# EasyEDA Pro project skyrizz_e32_se050.epro, board PCB1_8
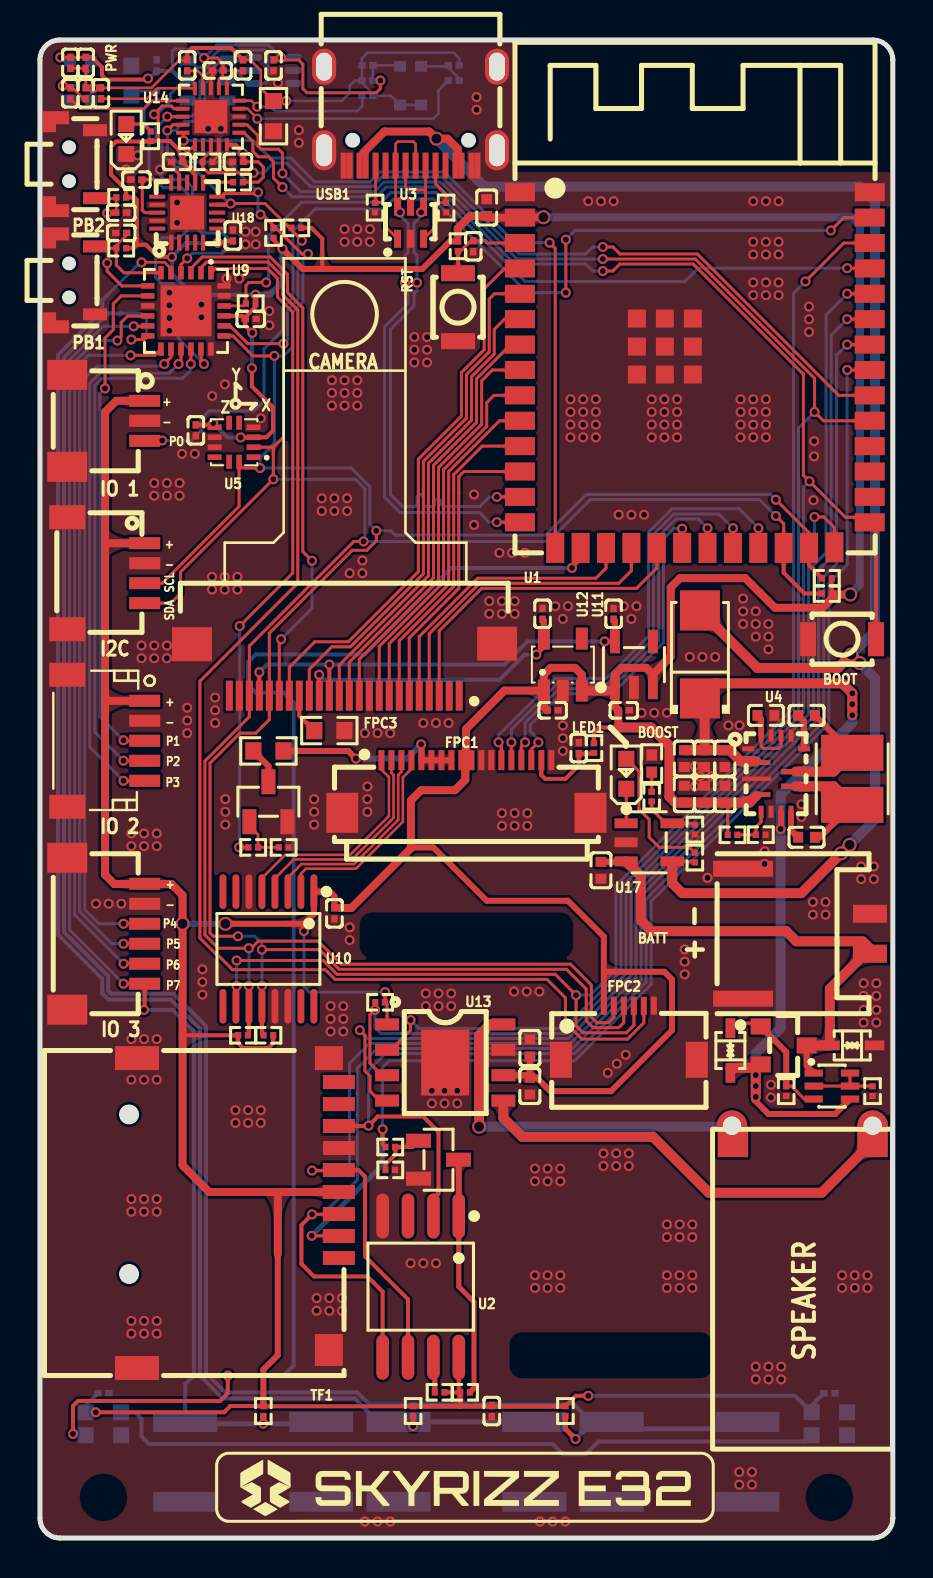
[diagram p6: board, top side]
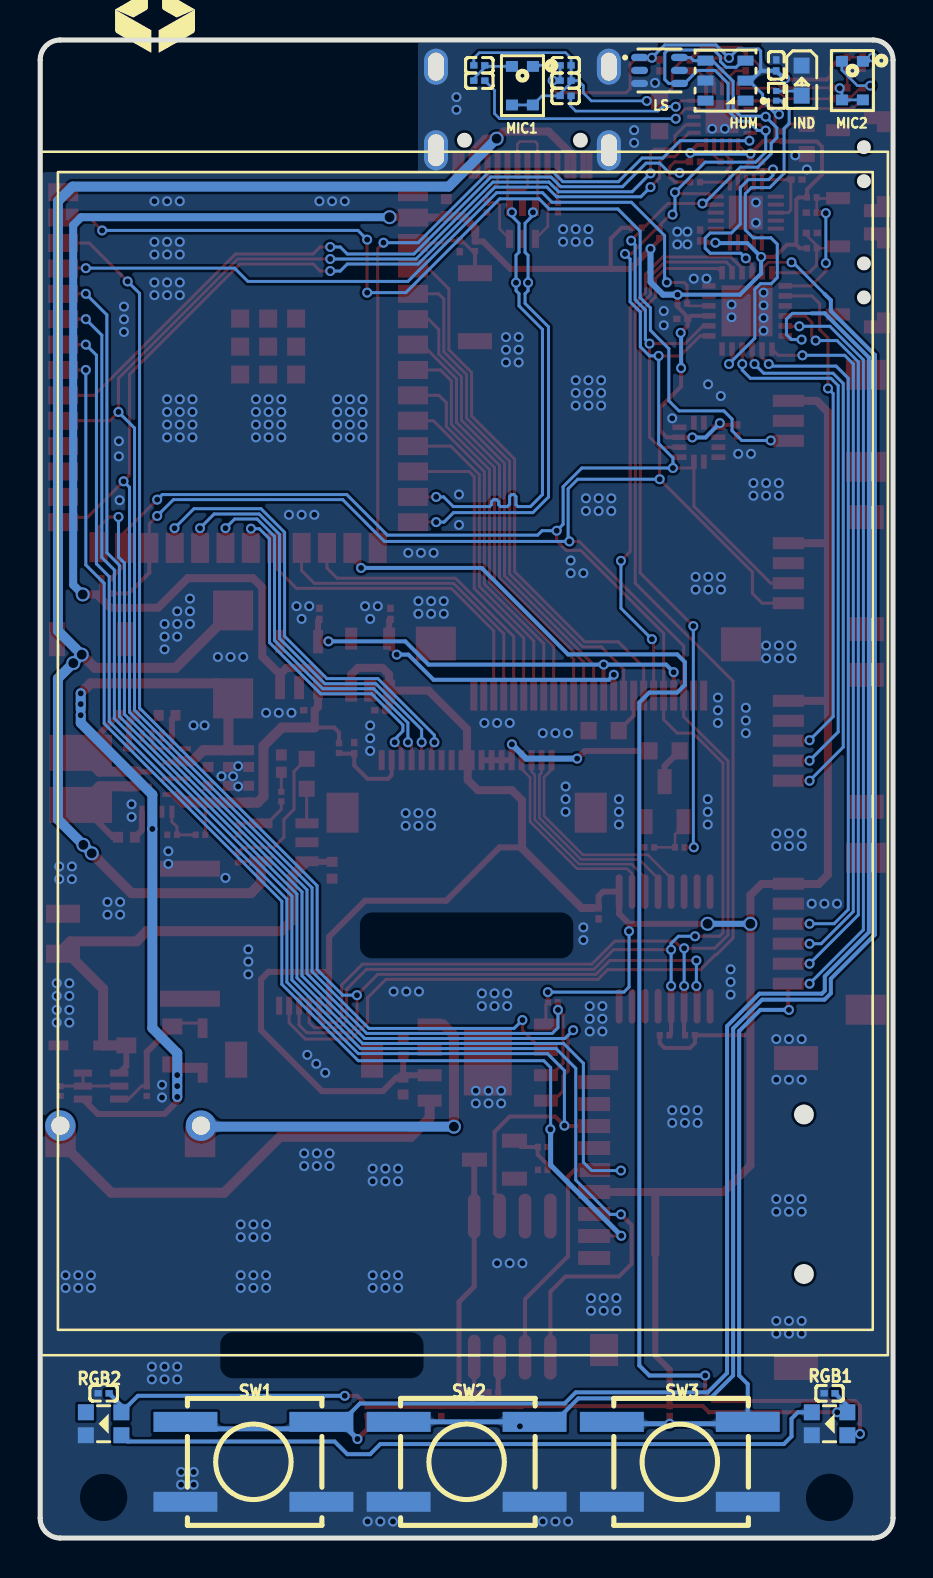
[diagram p7: board, bottom side, seen from below]

Outline 42.67 x 74.93 mm; copper layers: Top Layer, Bottom Layer. Coordinates in mm from the lower left corner of the outline.
Outline path: 0,73.93 0,1 arc(0.29,0.29) 1,0 41.67,0 arc(42.38,0.29) 42.67,1 42.67,73.93 arc(42.38,74.64) 41.67,74.93 1,74.93 arc(0.29,74.64) 0,73.93
Stack: Top Layer 0.035mm / Dielectric1 1.51mm FR4 er 4.5 / Bottom Layer 0.035mm

## Design rules (mm)
net DN: DP1
net DP: DP1
template: Custom Config
spacing copperThickness1oz (default): track to track 0.102, other pairs 0.102 to 0.3
spacing copperThickness2oz: track to track 0.203, other pairs 0.152 to 0.3
track width copperThickness1oz (default): min 0.127, default 0.254, max 2.54
track width copperThickness2oz: min 0.203, default 0.254, max 2.54
differential pair differentialPair (default): width min 0.127, default 0.254, max 2.54; gap min 0.152, default 0.152
via viaSize (default): diameter min 0.5, default 0.5, max 10; hole min 0.3, default 0.3, max 6.3

## Placement (name value [footprint] x y rotation side)
BATT  PH-2P卧贴  [CONN-SMD_2P-P2.00_PH2.0-SPWB]  38.35 30.23 90 top
BOOT  B3U-1000P  [KEY-SMD_B3U-1000PM]  40.13 44.96 0 top
C1  10uF  [C0402]  22.35 66.55 270 top
C2  22uF  [C0402]  24.51 22.61 90 top
C3  1uF  [C0201]  21.68 64.61 90 top
C6  15pF  [C0201]  20.7 73.66 180 bottom
C12  100nF  [C0201]  9.65 65.15 270 top
C18  100nF  [C0201]  16.38 73.66 0 bottom
C19  100nF  [C0201]  10.54 60.98 180 top
C20  100nF  [C0201]  4.06 66.29 180 top
C21  100nF  [C0201]  4.06 65.28 0 top
C22  100nF  [C0201]  39.5 7.24 180 bottom
C23  100nF  [C0201]  22.61 6.35 90 top
C24  100nF  [C0201]  3.18 7.24 180 bottom
C25  100nF  [C0201]  26.96 39.51 270 top
C26  1uF  [C0201]  16.38 72.9 0 bottom
C27  1uF  [C0201]  20.7 72.9 0 bottom
C28  1uF  [C0201]  16.38 72.14 0 bottom
C29  100nF  [C0201]  8.89 73.41 0 top
C30  100nF  [C0201]  6.86 68.83 0 top
C36  100nF  [C0201]  2.29 73.79 90 top
C37  1uF  [C0201]  1.52 73.79 90 top
C38  1uF  [C0201]  1.52 72.26 90 top
C39  1uF  [C0201]  3.05 72.26 90 top
C40  15pF  [C0201]  2.29 72.26 270 top
C41  100nF  [C0201]  9.91 68.83 0 top
C42  1uF  [C0201]  10.16 73.66 270 top
C43  1uF  [C0201]  7.37 73.66 270 top
C45  22uF  [C0402]  24.51 24.51 270 top
C46  2.2uF  [C0201]  29.21 41.4 180 top
C47  2.2uF  [C0201]  28.7 46.23 270 top
C48  2.2uF  [C0201]  25.65 41.4 180 top
C50  2.2uF  [C0201]  25.15 46.23 270 top
C51  10uF  [C0402]  33.25 38.98 90 top
C52  10uF  [C0402]  32.24 38.98 90 top
C54  1uF  [C0402]  36.32 41.15 0 top
C56  100nF  [C0402]  38.35 41.15 0 top
C57  100nF  [C0402]  38.35 35.05 0 top
C58  100nF  [C0402]  34.27 38.98 90 top
C59  10uF  [C0402]  34.27 37.21 270 top
C60  10uF  [C0402]  33.25 37.21 270 top
C61  100nF  [C0402]  32.24 37.21 270 top
C62  100nF  [C0201]  5.84 73.66 270 bottom
C63  100nF  [C0201]  11.68 73.66 90 top
C64  100nF  [C0201]  7.8 55.4 90 top
C65  100nF  [C0201]  14.73 31.24 90 top
C66  10uF  [C0402]  28.07 33.4 90 top
C67  100nF  [C0201]  4.83 67.94 0 top
C_I2C  SM04B-SRSS-TB(LF)(SN)  [CONN-SMD_4P-P1.00_SM04B-SRSS-TB-LF-SN]  3.3 48.26 270 top
C_P0  SM03B-SRSS-TB(LF)(SN)  [CONN-SMD_SM03B-SRSS-TB-LF-SN-P]  3.3 55.88 270 top
C_P1-3  SM05B-SRSS-TB(LF)(SN)  [CONN-SMD_SM05B-SRSS-TB-LF-SN]  3.3 39.88 270 top
C_P4-7  SM06B-SRSS-TB(LF)(SN)  [CONN-SMD_SM06B-SRSS-TB-LF-SN]  3.3 30.23 270 top
D2  SS34  [SMA_L4.3-W2.6-LS5.2-RD]  33.02 44.2 90 top
D5  PTVSUC3D5VB  [SOD-323_L1.8-W1.3-LS2.5-BI]  40.64 24.64 180 top
D6  PTVSUC3D5VB  [SOD-323_L1.8-W1.3-LS2.5-BI]  34.54 24.38 90 top
FPC1  FPC-0.5FX-18PWBH15  [FPC-SMD_18P-P0.50_XUNPU_FPC-0.5FX-18PWBH15]  21.34 37.59 0 top
FPC2  FPC06-T1T1-2021-A  [FPC-SMD_FPC06-T1T1-2021-A]  29.46 25.27 0 top
FPC3  FPC-0.5FX-24PH20  [FPC-SMD_24P-P0.50_YUANDI_FPC-0.5FX-24PH20]  15.24 43.43 180 top
HUM  AHT20  [SENSOR-SMD_L3.0-W3.0-P1.00-BR]  8.38 72.9 180 bottom
IND  KT-0603YG  [LED0603-RD]  4.57 72.9 270 bottom
L1  2.2uH  [IND-SMD_L3.5-W3.0]  40.64 37.97 90 top
LED1  KT-0603R  [LED0603-RD]  29.34 38.23 90 top
LS  LTR-303ALS-01  [TDFN-6_L2.0-W2.0-P0.65-BL]  11.68 73.41 270 bottom
MIC1  MSM381ACP003  [MIC-SMD_4P-L2.8-W1.9-TR_MSM381ACP003]  18.54 72.64 180 bottom
MIC2  MSM381ACP003  [MIC-SMD_4P-L2.8-W1.9-TR_MSM381ACP003]  2.03 72.9 180 bottom
NOREF  -  [Pad_e582]  41.66 19.81 0 top
NOREF#2  -  [Pad_e83]  41.66 20.62 0 top
NOREF#3  -  [Pad_e581]  34.67 19.81 0 top
NOREF#4  -  [Pad_e85]  34.62 20.62 0 top
PB1  TS24CA  [SW-SMD_2P-TS24CA]  1.78 62.9 90 top
PB2  TS24CA  [SW-SMD_2P-TS24CA]  1.78 68.72 90 top
PWR  KT-0603R  [LED0603-RD]  4.32 69.98 90 top
Q2  AO3401A  [SOT-23-3_L2.9-W1.3-P1.90-LS2.4-BR_SMV2022-004LF]  37.21 24.64 180 top
Q3  BCM857BS  [SOT-363_L2.1-W1.3-P0.65-LS2.3-BL]  39.62 22.61 270 top
Q4  MMBT3904  [SOT-23-3_L2.9-W1.3-P1.90-LS2.4-BR]  11.43 36.83 270 top
Q5  MMBT3904  [SOT-23-3_L2.9-W1.3-P1.90-LS2.4-BR]  19.94 18.92 180 top
R1  10kΩ  [R0201]  20.92 64.61 90 top
R2  1kΩ  [R0201]  32.77 34.04 90 top
R3  5.1kΩ  [R0201]  16.76 66.55 90 top
R4  10kΩ  [R0201]  17.02 26.8 0 top
R5  5.1kΩ  [R0201]  20.32 66.55 270 top
R6  10kΩ  [R0201]  4.06 67.06 0 top
R7  10kΩ  [R0201]  4.06 64.52 0 top
R12  10kΩ  [R0201]  39.37 47.24 180 top
R13  10kΩ  [R0201]  39.37 48.01 0 top
R14  10kΩ  [R0201]  10.54 61.74 0 top
R15  2kΩ  [R0201]  5.54 70.11 270 top
R16  2kΩ  [R0201]  5.84 72.14 90 bottom
R17  4.7Ω  [R0603]  11.43 39.37 0 top
R18  10kΩ  [R0201]  12.19 34.54 180 top
R19  2kΩ  [R0201]  10.67 34.54 180 top
R20  10kΩ  [R0201]  27.72 39.51 90 top
R21  3.3kΩ  [R0201]  8.38 68.83 0 top
R22  0Ω  [R0603]  11.68 71.12 270 top
R23  27kΩ  [R0201]  34.65 35.17 180 top
R24  10kΩ  [R0201]  36.07 35.18 0 top
R25  100kΩ  [R0201]  41.66 22.35 90 top
R26  100kΩ  [R0201]  37.34 22.35 90 top
R27  10kΩ  [R0201]  17.53 18.41 180 top
R28  10kΩ  [R0201]  17.53 19.56 180 top
R29  10kΩ  [R0201]  21.27 7.29 180 top
R31  10kΩ  [R0201]  20 7.29 180 top
R32  0Ω  [R0603]  14.48 40.39 0 top
R33  10kΩ  [R0201]  10.16 25.15 0 top
R34  10kΩ  [R0201]  11.43 25.15 0 top
R35  10kΩ  [R0201]  12.83 65.53 180 top
R36  10kΩ  [R0201]  11.68 65.28 270 top
R37  10kΩ  [R0201]  26.29 6.35 90 top
R38  10kΩ  [R0201]  18.67 6.35 90 top
R39  10kΩ  [R0201]  11.18 6.35 90 top
R40  10kΩ  [R0201]  32.77 35.43 90 top
R41  2kΩ  [R0201]  30.61 37.08 90 top
R42  0Ω  [R0402]  30.61 38.73 90 top
R43  10kΩ  [R0201]  9.91 67.82 0 top
RGB1  XL-0807RGBC-2812B  [LED-SMD_4P-L2.0-W1.8_XL-0807RGBC-WS2812B]  3.18 5.72 180 bottom
RGB2  XL-0807RGBC-2812B  [LED-SMD_4P-L2.0-W1.8_XL-0807RGBC-WS2812B]  39.5 5.72 180 bottom
RST  B3U-1000P  [KEY-SMD_B3U-1000PM]  20.92 61.56 270 top
SW1  EVQQ2B03W  [KEY-SMD_4P-L6.5-W6.0-P4.0-LS6.6]  32 3.81 180 bottom
SW2  EVQQ2B03W  [KEY-SMD_4P-L6.5-W6.0-P4.0-LS6.6]  21.34 3.81 180 bottom
SW3  EVQQ2B03W  [KEY-SMD_4P-L6.5-W6.0-P4.0-LS6.6]  10.67 3.81 180 bottom
TF1  TF-CARD H1.8  [TF-SMD_TF-CARD-H1.8]  9.91 16.26 270 top
U1  ESP32-S3-WROOM-1-N16R8  [WIRELM-SMD_ESP32-S3-WROOM-1]  32.77 58.42 0 top
U2  GT30L24A3W  [SOIC-8_L5.3-W5.3-P1.27-LS8.0-BL]  19.05 12.57 180 top
U3  PUSB2X4Y  [SOT-363-6_L2.0-W1.3-P0.65-LS2.1-BL]  18.54 65.79 0 top
U4  JW3651QFNE#TRPBF  [QFN-15_L4.0-W3.0_JW3655E]  36.83 38.23 0 top
U5  SC7A20HTR  [LGA-12_L2.0-W2.0-P0.50-TL]  9.71 54.81 180 top
U9  XL9535QF24  [QFN-24_L4.0-W4.0-P0.50-BL-EP2.6]  7.3 61.38 180 top
U10  TSC2007IPWR  [TSSOP-16_L5.0-W4.4-P0.65-LS6.4-BL]  11.43 29.46 180 top
U11  BL8555-28PRA  [SOT-23-5_L3.0-W1.7-P0.95-LS2.8-BL]  29.72 43.69 0 top
U12  AP7343Q-18W5-7  [SOT-23-5_L3.0-W1.7-P0.95-LS2.8-BR]  26.16 43.69 270 top
U13  NS4168  [ESOP-8_L4.9-W3.9-P1.27-LS6.0-BL-EP]  20.28 23.78 270 top
U14  ES7243E  [QFN-20_L3.0-W3.0-P0.40-BL-EP1.7]  8.55 71.09 0 top
U17  MCP73831T-2ACI/OT  [SOT-23-5_L3.0-W1.7-P0.95-LS2.8-BL]  30.48 34.8 270 top
U18  SE050C2HQ1/Z01SDZ  [WQFN-20_L3.0-W3.0-P0.40-BL-EP1.7]  7.37 66.29 0 top
USB1  USB-TYPE-C-018  [USB-C_SMD-TYPE-C-31-M-12]  18.54 71.12 180 top

## Footprints (pads in the part's own frame, mm; a bottom-side part is the same pattern mirrored in y, then rotated)
C0201
  rect 0.368x0.324 smd: 1(-0.275,0) 2(0.275,0)
C0402
  rect 0.5x0.54 smd: 1(-0.42,0) 2(0.42,0)
CONN-SMD_2P-P2.00_PH2.0-SPWB
  rect 0.9x1.7 smd: 1(1,-3.175) 2(-1,-3.175)
  rect 0.8x3 smd: 3(-3.25,3.175) 4(3.25,3.175)
CONN-SMD_4P-P1.00_SM04B-SRSS-TB-LF-SN
  rect 0.6x1.55 smd: 1(-1.5,1.938) 2(-0.5,1.938) 3(0.5,1.938) 4(1.5,1.938)
  rect 1.2x1.8 smd: 5(2.8,-1.938) 6(-2.8,-1.938)
CONN-SMD_SM03B-SRSS-TB-LF-SN-P
  rect 0.6x1.55 smd: 1(-1,1.938) 2(0,1.938) 3(1,1.938)
  rect 1.5x2 smd: 4(2.3,-1.938) 5(-2.3,-1.938)
CONN-SMD_SM05B-SRSS-TB-LF-SN
  rect 0.6x1.55 smd: 1(-2,1.938) 2(-0.999,1.938) 3(0.001,1.938) 4(1,1.938) 5(2.001,1.938)
  rect 1.2x1.8 smd: 6(-3.3,-1.938) 7(3.3,-1.938)
CONN-SMD_SM06B-SRSS-TB-LF-SN
  rect 0.6x1.55 smd: 1(-2.5,1.938) 2(-1.5,1.938) 3(-0.5,1.938) 4(0.5,1.938) 5(1.5,1.938) 6(2.5,1.938)
  rect 1.5x2 smd: 7(3.8,-1.938) 8(-3.8,-1.938)
ESOP-8_L4.9-W3.9-P1.27-LS6.0-BL-EP
  rect 0.6x1.2 smd: 1(-1.905,-2.909) 2(-0.635,-2.909) 3(0.635,-2.909) 4(1.905,-2.909) 5(1.905,2.909) 6(0.635,2.909) 7(-0.635,2.909) 8(-1.905,2.909)
  rect 3.3x2.4 smd: 9(0,0)
FPC-SMD_18P-P0.50_XUNPU_FPC-0.5FX-18PWBH15
  rect 0.3x1 smd: 1(-4.25,1.315) 2(-3.75,1.315) 3(-3.25,1.315) 4(-2.75,1.315) 5(-2.25,1.315) 6(-1.75,1.315) 7(-1.25,1.315) 8(-0.75,1.315) 9(-0.25,1.315) 10(0.25,1.315) 11(0.75,1.315) 12(1.25,1.315) 13(1.75,1.315) 14(2.25,1.315) 15(2.75,1.315) 16(3.25,1.315) 17(3.75,1.315) 18(4.25,1.315)
  rect 1.6x2 smd: 19(6.21,-1.315) 20(-6.21,-1.315)
FPC-SMD_24P-P0.50_YUANDI_FPC-0.5FX-24PH20
  rect 0.35x1.5 smd: 1(-5.735,1.3) 2(-5.235,1.3) 3(-4.735,1.3) 4(-4.235,1.3) 5(-3.735,1.3) 6(-3.235,1.3) 7(-2.735,1.3) 8(-2.235,1.3) 9(-1.735,1.3) 10(-1.235,1.3) 11(-0.735,1.3) 12(-0.235,1.3) 13(0.265,1.3) 14(0.765,1.3) 15(1.265,1.3) 16(1.765,1.3) 17(2.265,1.3) 18(2.765,1.3) 19(3.265,1.3) 20(3.765,1.3) 21(4.265,1.3) 22(4.765,1.3) 23(5.265,1.3) 24(5.765,1.3)
  rect 2x1.7 smd: 25(7.635,-1.27) 26(-7.635,-1.3)
FPC-SMD_FPC06-T1T1-2021-A
  rect 0.3x0.9 smd: 1(-1.25,1.35) 2(-0.75,1.35) 3(-0.25,1.35) 4(0.25,1.35) 5(0.75,1.35) 6(1.25,1.35)
  rect 1.1x1.8 smd: 7(3.4,-1.35) 8(-3.4,-1.35)
IND-SMD_L3.5-W3.0
  rect 1.8x3.12 smd: 1(1.303,0) 2(-1.303,0)
KEY-SMD_4P-L6.5-W6.0-P4.0-LS6.6
  rect 3.2x1 smd: 1(-3.4,2) 2(3.4,2) 3(-3.4,-2) 4(3.4,-2)
KEY-SMD_B3U-1000PM
  rect 0.8x1.7 smd: 1(-1.7,0) 2(1.7,0)
LED0603-RD
  rect 0.8x0.8 smd: 1(-0.749,0) 2(0.749,0)
LED-SMD_4P-L2.0-W1.8_XL-0807RGBC-WS2812B
  rect 0.8x0.8 smd: 1(-0.889,0.575) 2(-0.889,-0.575) 3(0.889,-0.575) 4(0.889,0.575)
LGA-12_L2.0-W2.0-P0.50-TL
  rect 0.7x0.28 smd: 1(-0.975,0.75) 2(-0.975,0.25) 3(-0.975,-0.25) 4(-0.975,-0.75) 7(0.975,-0.75) 8(0.975,-0.25) 9(0.975,0.25) 10(0.975,0.75)
  rect 0.28x0.7 smd: 5(-0.25,-0.975) 6(0.25,-0.975) 11(0.25,0.975) 12(-0.25,0.975)
MIC-SMD_4P-L2.8-W1.9-TR_MSM381ACP003
  rect 0.6x0.54 smd: 1(0.525,0.965) 2(-0.525,0.965) 3(-0.525,-0.965) 4(0.525,-0.965)
Pad_e83
  round 1.524 hole 0.914: 1(0,0)
Pad_e85
  round 1.524 hole 0.914: 2(0,0)
Pad_e581
  rect 1.524x1.524 smd: 2(0,0)
Pad_e582
  rect 1.524x1.524 smd: 1(0,0)
QFN-15_L4.0-W3.0_JW3655E
  rect 0.6x0.25 smd: 1(-1.4,1.25) 11(1.4,1.25)
  custom 1.42x0.45 smd: 2(-0.99,0.62) 4(-0.99,-1.1)
  custom 1.45x0.22 smd: 3(-0.875,-0.25)
  rect 0.25x0.6 smd: 5(-0.75,-1.9) 6(-0.25,-1.9) 7(0.25,-1.9) 8(0.75,-1.9) 12(0.75,1.9) 13(0.25,1.9) 14(-0.25,1.9) 15(-0.75,1.9)
  custom 1.45x0.4 smd: 9(0.975,-0.625) 10(0.975,0.105)
QFN-20_L3.0-W3.0-P0.40-BL-EP1.7
  rect 0.2x0.665 smd: 1(-0.8,-1.407) 2(-0.4,-1.407) 3(0,-1.407) 4(0.4,-1.407) 5(0.8,-1.407) 11(0.8,1.407) 12(0.4,1.407) 13(0,1.407) 14(-0.4,1.407) 15(-0.8,1.407)
  rect 0.665x0.2 smd: 6(1.407,-0.8) 7(1.407,-0.4) 8(1.407,0) 9(1.407,0.4) 10(1.407,0.8) 16(-1.407,0.8) 17(-1.407,0.4) 18(-1.407,0) 19(-1.407,-0.4) 20(-1.407,-0.8)
  rect 1.65x1.65 smd: 21(0,0)
QFN-24_L4.0-W4.0-P0.50-BL-EP2.6
  rect 0.28x0.665 smd: 1(-1.25,-1.907) 2(-0.75,-1.907) 3(-0.25,-1.907) 4(0.25,-1.907) 5(0.75,-1.907) 6(1.25,-1.907) 13(1.25,1.907) 14(0.75,1.907) 15(0.25,1.907) 16(-0.25,1.907) 17(-0.75,1.907) 18(-1.25,1.907)
  rect 0.665x0.28 smd: 7(1.907,-1.25) 8(1.907,-0.75) 9(1.907,-0.25) 10(1.907,0.25) 11(1.907,0.75) 12(1.907,1.25) 19(-1.907,1.25) 20(-1.907,0.75) 21(-1.907,0.25) 22(-1.907,-0.25) 23(-1.907,-0.75) 24(-1.907,-1.25)
  rect 2.55x2.55 smd: 25(0,0)
R0201
  rect 0.303x0.324 smd: 1(-0.241,0) 2(0.241,0)
R0402
  rect 0.566x0.54 smd: 1(-0.433,0) 2(0.433,0)
R0603
  rect 0.806x0.864 smd: 1(-0.753,0) 2(0.753,0)
SENSOR-SMD_L3.0-W3.0-P1.00-BR
  rect 0.8x0.5 smd: 1(1,-1) 2(1,0) 3(1,1) 4(-1,1) 5(-1,0) 6(-1,-1)
SMA_L4.3-W2.6-LS5.2-RD
  rect 2x2 smd: 1(-2.2,0) 2(2.2,0)
SOD-323_L1.8-W1.3-LS2.5-BI
  rect 0.985x0.49 smd: 1(-1.117,0) 2(1.117,0)
SOIC-8_L5.3-W5.3-P1.27-LS8.0-BL
  oval 0.63x2.25 smd: 1(-1.905,-3.53) 2(-0.635,-3.53) 3(0.635,-3.53) 4(1.905,-3.53) 5(1.905,3.53) 6(0.635,3.53) 7(-0.635,3.53) 8(-1.905,3.53)
SOT-23-3_L2.9-W1.3-P1.90-LS2.4-BR
  rect 1.25x0.7 smd: 1(1,-0.95) 2(1,0.95) 3(-1,0)
SOT-23-3_L2.9-W1.3-P1.90-LS2.4-BR_SMV2022-004LF
  rect 1x0.8 smd: 1(1.15,-0.95) 2(1.15,0.95) 3(-1.15,0)
SOT-23-5_L3.0-W1.7-P0.95-LS2.8-BL
  rect 0.49x1.157 smd: 1(-0.95,-1.153) 2(0,-1.153) 3(0.95,-1.153)
  rect 0.49x1.175 smd: 4(0.95,1.153) 5(-0.95,1.153)
SOT-23-5_L3.0-W1.7-P0.95-LS2.8-BR
  rect 1.1x0.6 smd: 1(1.3,-0.95) 2(1.3,0) 3(1.3,0.95) 4(-1.3,0.95) 5(-1.3,-0.95)
SOT-363-6_L2.0-W1.3-P0.65-LS2.1-BL
  rect 0.35x0.9 smd: 1(-0.65,-0.8) 2(0,-0.8) 3(0.65,-0.8) 4(0.65,0.8) 5(0,0.8) 6(-0.65,0.8)
SOT-363_L2.1-W1.3-P0.65-LS2.3-BL
  rect 0.35x0.916 smd: 1(-0.65,-0.908) 2(0,-0.908) 3(0.65,-0.908) 4(0.65,0.908) 5(0,0.908) 6(-0.65,0.908)
SW-SMD_2P-TS24CA
  rect 0.6x1.2 smd: 1(-1.7,-0.975) 2(1.7,-0.975)
  custom 1.05x1.3 smd: 3(2.125,0.975) 4(-2.125,0.975)
TDFN-6_L2.0-W2.0-P0.65-BL
  oval 0.364x0.847 smd: 1(-0.65,-0.999) 2(0,-0.999) 3(0.65,-0.999) 4(0.65,0.999) 5(0,0.999) 6(-0.65,0.999)
TF-SMD_TF-CARD-H1.8
  rect 0.7x1.6 smd: 1(2.25,5.05) 2(1.15,5.05) 3(0.05,5.05) 4(-1.05,5.05) 5(-2.15,5.05) 6(-3.25,5.05) 7(-4.35,5.05) 8(-5.45,5.05) 9(-6.55,5.05)
  rect 1.2x1.4 smd: 10(-7.747,4.55)
  rect 1.2x2.2 smd: 11(-7.75,-5.05) 12(7.75,-5.05)
  rect 1.6x1.4 smd: 13(6.85,4.55)
TSSOP-16_L5.0-W4.4-P0.65-LS6.4-BL
  oval 0.343x1.732 smd: 1(-2.275,-2.866) 2(-1.625,-2.866) 3(-0.975,-2.866) 4(-0.325,-2.866) 5(0.325,-2.866) 6(0.975,-2.866) 7(1.625,-2.866) 8(2.275,-2.866) 9(2.275,2.866) 10(1.625,2.866) 11(0.975,2.866) 12(0.325,2.866) 13(-0.325,2.866) 14(-0.975,2.866) 15(-1.625,2.866) 16(-2.275,2.866)
USB-C_SMD-TYPE-C-31-M-12
  oval 1.2x2 hole 0.8x1.6: 0(-4.325,1.706) 1(4.325,1.706)
  oval 1.2x1.8 hole 0.8x1.4: 2(4.325,-2.474) 3(-4.325,-2.474)
  rect 0.3x1.3 smd: A1(-3.35,2.474) A4(-2.55,2.474) A5(-1.25,2.474) A6(-0.25,2.474) A7(0.25,2.474) A8(1.25,2.474) A9(2.55,2.474) A12(3.35,2.474) B1(3.05,2.474) B4(2.25,2.474) B5(1.75,2.474) B6(0.75,2.474) B7(-0.75,2.474) B8(-1.75,2.474) B9(-2.25,2.474) B12(-3.05,2.474)
WIRELM-SMD_ESP32-S3-WROOM-1
  rect 1.5x0.9 smd: 1(-8.75,8.895) 2(-8.75,7.625) 3(-8.75,6.355) 4(-8.75,5.085) 5(-8.75,3.815) 6(-8.75,2.545) 7(-8.75,1.275) 8(-8.75,0.005) 9(-8.75,-1.265) 10(-8.75,-2.535) 11(-8.75,-3.805) 12(-8.75,-5.075) 13(-8.75,-6.345) 14(-8.75,-7.615) 27(8.75,-7.615) 28(8.75,-6.345) 29(8.75,-5.075) 30(8.75,-3.805) 31(8.75,-2.535) 32(8.75,-1.265) 33(8.75,0.005) 34(8.75,1.275) 35(8.75,2.545) 36(8.75,3.815) 37(8.75,5.085) 38(8.75,6.355) 39(8.75,7.625) 40(8.75,8.895)
  rect 0.9x1.5 smd: 15(-6.985,-8.895) 16(-5.715,-8.895) 17(-4.445,-8.895) 18(-3.175,-8.895) 19(-1.905,-8.895) 20(-0.635,-8.895) 21(0.635,-8.895) 22(1.905,-8.895) 23(3.175,-8.895) 24(4.445,-8.895) 25(5.715,-8.895) 26(6.985,-8.865)
  rect 0.9x0.9 smd: 41(-2.9,2.575) 41(-2.9,1.175) 41(-2.9,-0.225) 41(-1.5,2.575) 41(-1.5,1.175) 41(-1.5,-0.225) 41(-0.1,2.575) 41(-0.1,1.175) 41(-0.1,-0.225)
WQFN-20_L3.0-W3.0-P0.40-BL-EP1.7
  rect 0.2x0.8 smd: 1(-0.8,-1.5) 2(-0.4,-1.5) 3(0,-1.5) 4(0.4,-1.5) 5(0.8,-1.5) 11(0.8,1.5) 12(0.4,1.5) 13(0,1.5) 14(-0.4,1.5) 15(-0.8,1.5)
  rect 0.8x0.2 smd: 6(1.5,-0.8) 7(1.5,-0.4) 8(1.5,0) 9(1.5,0.4) 10(1.5,0.799) 16(-1.5,0.8) 17(-1.5,0.4) 18(-1.5,0) 19(-1.5,-0.4) 20(-1.5,-0.8)
  rect 1.7x1.7 smd: 21(0,0)

## Nets
As in the schematic, except:
$6N1590: NOREF#3.2 NOREF#4.2 U13.8
$6N1591: NOREF.1 NOREF#2.1 U13.5

Pads without a net: FPC3 1 2 24; HUM 1 6; LS 2 5; RGB2 1; TF1 1 8 9; U1 28 29 30; U2 3; U3 5; U5 1 5 6 10 11; U10 7 8 9 15 16; U11 4; U12 4; U14 2; U18 2 3 4 5 6 7 8 13 16 20; USB1 A8 B8

## Via types
v1: diameter 0.5, hole 0.3, Top Layer to Bottom Layer, 496 vias
v2: diameter 0.7, hole 0.5, Top Layer to Bottom Layer, 10 vias

## Routing (per net, layer and track width the routed paths; a pad name or vN(x,y) marks a point on that pad's centre or on a via; arc(x,y) is an arc through that point)
1V8: length 14.5
  Top Layer w0.2: U12.5 25.21,44.57 v1(24.83,44.19) ; 13.97,42.13 13.97,42.14 v1(13.97,43.18)
  Top Layer w0.3: U12.5 25.21,45.89 C50.2
  Bottom Layer w0.2: v1(13.97,43.18) 14.22,42.93 22.99,42.93 24.25,44.19 v1(24.83,44.19)
2V8: length 22.3
  Top Layer w0.2: U11.5 28.26,44.84 v1(28.25,44.85) ; 14.47,42.13 14.48,42.14 v1(14.48,43.69) ; 10.97,42.13 v1(10.97,43.31)
  Top Layer w0.3: U11.5 28.77,45.89 C47.2
  Bottom Layer w0.2: v1(10.97,43.31) 11.36,43.69 v1(14.48,43.69) 23.24,43.69 24.4,44.85 v1(28.25,44.85)
3V3: length 359
  Top Layer w0.13: 8.58,55.68 8.62,55.68 U5.7 ; 7.75,69.69 7.13,69.07 ; C29.2 9.14,73.39 9.14,73.15 8.95,72.96 U14.12 ; C36.2 C37.2 v1(1.02,74.06)
  Top Layer w0.15: v1(17.27,27.3) 17.27,26.81 R4.2 17.37,26.69 U13.1 ; R43.2 10.92,67.82 11.18,68.07 11.18,68.58 10.92,68.83 C41.2 ; C29.2 9.16,73.74 8.87,74.03 v1(8.21,74.03) ; v1(13.21,30.35) 13.21,30.36 13.21,30.72 ; R23.2 34.41,36.65 C59.2 ; 5.91,69.87 5.91,69.88 5.91,71.42 6.12,71.63 6.57,71.63 6.71,71.49 7.15,71.49 ; C63.2 12.94,73.93 13.15,73.72 13.15,72.49 13.36,72.29 16.83,72.29 17.03,72.49 v1(17.03,72.9)
  Top Layer w0.2: v1(10.6,58.52) 10.6,57.6 11.66,56.55 11.66,55.39 11.33,55.06 U5.3 10.68,55.05 v1(10.04,55.05) ; 7.14,25.13 7.16,25.15 R33.1 9.91,25.13 9.91,24.77 10.16,24.51 11.43,24.51 11.67,24.75 R34.2 ; R31.1 R29.2 20.96,7.36 U2.8 ; 4.84,64.69 4.84,66.93 4.72,67.06 R6.2 4.31,67.45 3.56,68.2 3.56,69.6 3.81,69.85 5.52,69.85 R15.2 6.51,69.87 v1(7.13,69.25) C30.2 7.13,68.81 7.77,68.18 U18.12 ; 4.84,64.69 5.3,64.69 5.92,64.08 v1(6.6,64.08) ; 4.84,64.69 4.67,64.52 R7.2 ; FPC1.9 FPC1.10 ; v1(5.4,73) 5.35,72.95 3.31,72.95 3.11,73.16 3.11,73.56 2.61,74.06 C36.2 ; C41.2 10.18,69.3 9.79,69.69 U14.5 ; C12.2 9.32,64.88 9.24,64.79 v1(8.89,64.79) ; R20.2 27.72,40.29 27.97,40.54 28.94,40.54 ; R35.1 13.59,65.53 14.12,65 14.12,63.48 14.12,63.48 ; v1(2.79,6.29) 9.21,6.29 9.53,6.6 11.16,6.6 R39.2 R38.2 ; R14.2 10.79,61.59 10.27,61.07 C19.2 ; 20.91,65.15 20.91,64.86 R1.2 ; C19.2 10.12,61.13 U9.21 ; C19.2 10.27,60.64 v1(10.62,60.28) ; C65.2 14.99,31.52 14.99,31.51 ; 10.78,61.74 v1(10.78,62.19) ; C64.2 8.58,55.68 ; v1(27.43,7.11) 26.81,7.11 R37.2 ; R36.2 11.68,64.94 v1(12.13,64.48) ; R13.2 R12.1
  Top Layer w0.25: 21.03,6.59 R37.2 ; 21.03,6.59 R38.2 ; 21.03,6.59 21.02,6.59 R29.2
  Top Layer w0.3: 28.21,28.32 28.21,30.08 26.42,31.88 22.35,31.88 19.69,34.54 18.61,34.54 18.56,34.5 ; 28.21,28.32 28.21,26.62 ; 28.21,28.32 31.24,28.32 31.62,27.94 31.62,25.4 28.58,22.35 25.53,22.35 24.85,23.03 C2.2 ; R39.2 11.18,8.42 11.9,9.15 11.9,14.2 ; U13.6 24.39,23.15 C2.2 ; C2.2 C45.2 ; v1(12.13,64.48) 13.14,63.48 19.13,63.48 20.51,64.85 R1.2 ; C65.2 14.73,32.1 14.5,32.33 U10.1 13.71,31.22 13.21,30.72 v2(9.28,30.72)
  Top Layer w0.4: 3.26,49.75 3.27,49.76 C_I2C.1 ; 3.26,49.75 3.26,56.33 3.81,56.88 C_P0.1 ; 3.26,49.75 3.26,41.87 ; v2(40.54,47.2) 39.83,47.2 39.16,46.53 36.77,46.53 35.29,48.01 32.02,48.01 31.56,47.55 31.56,44.09 30.67,43.2 ; 5.23,32.71 3.72,32.71 3.26,33.17 3.26,41.87 ; 5.23,32.71 C_P4-7.1 ; 5.23,32.71 6.57,32.71 7.14,32.15 v2(7.14,30.72) 7.14,18.64 8.47,17.31 11.9,17.31 ; 11.9,17.31 11.9,14.2 ; 11.9,17.31 TF1.4 ; 30.67,43.2 U11.3 ; 30.67,43.2 30.34,43.52 29.12,43.52 28.77,43.17 U11.1 28.77,41.57 C46.2 28.94,40.54 ; 20.91,65.15 20.91,65.5 21.53,66.13 C1.2 22.44,66.05 U1.2 24.04,66.07 v2(25.19,66.07) ; C_P1-3.1 3.27,41.88 3.26,41.87 ; U12.3 27.11,43.18 26.77,43.52 25.55,43.52 25.21,43.19 U12.1 ; U12.1 25.21,41.57 C48.2 ; U12.1 23.24,42.39 21.31,40.46 21.31,38.92 21.33,38.91 21.28,38.86 21.28,37.92 20.76,37.4 19.07,37.4 18.56,36.89 18.56,34.5 15.58,31.51 14.99,31.51
  Top Layer w0.5: U11.1 28.62,42.39 U12.3 ; U4.4 35.5,36.79 C59.2 C60.2 C61.2 31.79,36.79 31.5,37.08 31.5,39.62 30.58,40.54 28.94,40.54
  Bottom Layer w0.13: MIC1.1 17.97,73.66 C18.2 C26.2 ; MIC2.1 1.21,73.86 v1(1.02,74.06) ; v1(12.06,74.04) 12.67,74.04 LS.1
  Bottom Layer w0.15: C26.2 16.66,72.9 v1(17.03,72.9) ; v1(13.21,30.35) 13.21,27.56 13.46,27.3 v1(17.27,27.3) ; 7.21,72.9 6.53,72.22 6.53,71.88 5.85,71.21 v1(5.71,71.21) ; 6.62,73.39 6.62,74.38 6.73,74.48 7.75,74.48 v1(8.21,74.03) 8.86,74.68 11.42,74.68 v1(12.06,74.04)
  Bottom Layer w0.2: v1(5.4,73) 5.46,73 C62.2 6.62,73.39 7.11,72.9 HUM.2 ; v1(7.13,69.25) 10.11,69.25 v1(10.15,69.28) ; v1(2.79,6.29) RGB1.4 2.29,6.62 C24.2 ; v1(10.62,60.28) 10.6,60.26 v1(10.6,58.52) ; v1(27.43,7.11) 37.79,7.11 RGB2.4 38.61,6.62 C22.2 ; v1(10.04,55.05) 9.38,55.05 v1(8.67,55.76) ; v1(8.89,64.79) 8.87,64.77 7.29,64.77 v1(6.6,64.08) 6.6,63.25 7.66,62.19 v1(10.78,62.19)
  Bottom Layer w0.3: v2(9.28,30.72) v2(7.14,30.72) ; v1(12.13,64.48) 12.13,62.82 11.5,62.19 v1(10.78,62.19)
  Bottom Layer w0.4: v2(40.54,47.2) 41.02,47.68 41.02,65.67 40.62,66.07 v2(25.19,66.07)
AGND: length 30.7
  Top Layer w0.13: C43.1 6.98,73.93 5.58,72.54 C39.2 2.69,72.54 ; v1(2.67,72.52) 2.69,72.54 ; 2.69,72.54 C40.1 C36.1 C37.1 ; v1(12.32,71.88) 11.69,71.88 R22.1 11.68,71.88 11.05,72.52 11.05,73.41 10.52,73.93 C42.1
  Top Layer w0.2: C43.1 7.37,74.3 7.6,74.53 9.56,74.53 C42.1
  Bottom Layer w0.13: MIC2.4 MIC2.3 2.56,72.41 v1(2.67,72.52) ; C26.1 C18.1 16.11,74.02 16.38,74.3 20.7,74.3 20.98,74.02 C6.1 ; C26.1 16.11,72.79 16.66,72.24 C28.2 17.56,72.14 18.02,71.68 19.07,71.68 ; C26.1 15.75,72.9 15.49,72.64 15.49,72.28 15.09,71.88 v1(12.32,71.88)
GND: length 1.9
  Top Layer w0.13: R21.2 8.95,69.16 U14.4 ; C29.1 8.62,73.15 8.55,73.09 U14.13
  vias: v1(2.8,31.73) v1(3.44,31.73) v1(4.07,31.73) v1(4.31,68.45) v1(4.57,35.24) v1(4.57,34.61) v1(4.57,24.96) v1(4.57,22.92) v1(4.57,16.95) v1(4.57,16.32) v1(4.57,10.86) v1(4.57,10.22) v1(4.89,69.16) v1(5.08,44.64) v1(5.08,44.01) v1(5.21,35.24) v1(5.21,34.61) v1(5.21,24.96) v1(5.21,22.92) v1(5.21,16.95) v1(5.21,16.32) v1(5.21,10.86) v1(5.21,10.22) v1(5.72,52.77) v1(5.72,52.13) v1(5.72,44.64) v1(5.72,44.01) v1(5.84,35.24) v1(5.84,34.61) v1(5.84,24.96) v1(5.84,22.92) v1(5.84,16.95) v1(5.84,16.32) v1(5.84,10.86) v1(5.84,10.22) v1(6.35,52.77) v1(6.35,52.13) v1(6.35,44.64) v1(6.35,44.01) v1(6.48,62.29) v1(6.48,61.66) v1(6.48,61.02) v1(6.48,60.39) v1(6.86,66.8) v1(6.86,65.79) v1(6.99,52.77) v1(6.99,52.13) v1(7.11,54.23) v1(7.37,41.53) v1(7.37,40.89) v1(7.37,40.26) v1(7.75,54.23) v1(8.08,61.7) v1(8.08,61.06) v1(8.13,28.45) v1(8.13,27.81) v1(8.13,27.18) v1(8.41,70.49) v1(8.62,57.12) v1(8.61,48.08) v1(8.61,47.44) v1(8.76,42.04) v1(8.76,41.4) v1(8.76,40.77) v1(9.05,70.49) v1(9.25,57.7) v1(9.24,48.08) v1(9.24,47.44) v1(9.27,36.96) v1(9.27,36.32) v1(9.27,35.69) v1(9.33,62.99) v1(9.78,21.4) v1(9.78,20.76) v1(9.88,48.08) v1(9.88,47.44) v1(9.97,62.99) v1(10.29,65.34) v1(10.29,64.71) v1(10.41,21.4) v1(10.41,20.76) v1(10.8,65.34) v1(10.8,64.71) v1(11.05,56.01) v1(11.05,21.4) v1(11.05,20.76) v1(11.47,61.37) v1(11.47,60.66) v1(11.91,72.78) v1(12.95,70.42) v1(12.95,69.79) v1(13.72,36.96) v1(13.72,36.32) v1(13.72,35.69) v1(13.84,12) v1(13.84,11.37) v1(14.1,52.01) v1(14.1,51.37) v1(14.48,12) v1(14.48,11.37) v1(14.54,26.61) v1(14.54,25.97) v1(14.54,25.34) v1(14.61,57.91) v1(14.61,57.28) v1(14.61,56.64) v1(14.73,52.01) v1(14.73,51.37) v1(15.18,26.61) v1(15.18,25.97) v1(15.18,25.34) v1(15.11,12) v1(15.11,11.37) v1(15.24,65.47) v1(15.24,64.83) v1(15.24,57.91) v1(15.24,57.28) v1(15.24,56.64) v1(15.37,52.01) v1(15.37,51.37) v1(15.49,48.26) v1(15.49,30.54) v1(15.49,29.91) v1(15.88,65.47) v1(15.88,64.83) v1(15.88,57.91) v1(15.88,57.28) v1(15.88,56.64) v1(16.13,48.89) v1(16.13,48.26) v1(16.26,40.26) v1(16.26,0.83) v1(16.38,37.59) v1(16.38,36.96) v1(16.38,36.32) v1(16.51,65.47) v1(16.51,64.83) v1(16.89,40.26) v1(16.89,0.83) v1(17.53,40.26) v1(17.53,0.83) v1(18.54,13.74) v1(18.73,60.07) v1(18.73,59.44) v1(18.73,58.8) v1(19.18,40.77) v1(19.18,13.74) v1(19.3,27.24) v1(19.3,26.61) v1(19.37,60.07) v1(19.37,59.44) v1(19.37,58.8) v1(19.61,22.37) v1(19.61,21.74) v1(19.81,40.77) v1(19.81,13.74) v1(19.94,27.24) v1(19.94,26.61) v1(20.24,22.37) v1(20.24,21.74) v1(20.45,40.77) v1(20.57,27.24) v1(20.57,26.61) v1(20.88,22.37) v1(20.88,21.74) v1(21.72,52.2) v1(21.72,50.67) v1(21.84,72.07) v1(21.84,71.44) v1(22.48,46.86) v1(22.48,46.23) v1(22.99,49.28) v1(23.11,46.86) v1(23.11,46.23) v1(23.11,36.26) v1(23.11,35.62) v1(23.62,49.28) v1(23.75,46.86) v1(23.75,46.23) v1(23.75,36.26) v1(23.75,35.62) v1(23.72,27.33) v1(24.26,49.28) v1(24.38,36.26) v1(24.38,35.62) v1(24.35,27.33) v1(24.77,18.48) v1(24.77,17.84) v1(24.77,13.14) v1(24.77,12.51) v1(24.99,27.33) v1(25.02,0.83) v1(25.4,18.48) v1(25.4,17.84) v1(25.4,13.14) v1(25.4,12.51) v1(25.65,0.83) v1(25.78,46.61) v1(26.03,18.48) v1(26.03,17.84) v1(26.03,13.14) v1(26.03,12.51) v1(26.16,45.97) v1(26.16,40.64) v1(26.16,40) v1(26.16,39.37) v1(26.29,0.83) v1(26.42,46.61) v1(26.54,56.96) v1(26.54,56.32) v1(26.54,55.69) v1(26.54,55.05) v1(27.18,56.96) v1(27.18,56.32) v1(27.18,55.69) v1(27.18,55.05) v1(27.43,66.87) v1(27.81,56.96) v1(27.81,56.32) v1(27.81,55.69) v1(27.81,55.05) v1(28.07,66.87) v1(28.19,19.24) v1(28.19,18.61) v1(28.41,23.27) v1(28.7,66.87) v1(28.86,23.72) v1(28.83,19.24) v1(28.83,18.61) v1(28.96,51.18) v1(29.21,46.61) v1(29.31,24.17) v1(29.46,19.24) v1(29.46,18.61) v1(29.59,51.18) v1(29.59,45.97) v1(29.84,46.61) v1(30.1,41.27) v1(30.23,51.18) v1(30.61,56.96) v1(30.61,56.32) v1(30.61,55.69) v1(30.61,55.05) v1(30.73,41.27) v1(31.24,56.96) v1(31.24,56.32) v1(31.24,55.69) v1(31.24,55.05) v1(31.37,41.27) v1(31.37,15.68) v1(31.37,15.05) v1(31.37,13.14) v1(31.37,12.51) v1(31.88,56.96) v1(31.88,56.32) v1(31.88,55.69) v1(31.88,55.05) v1(32,15.68) v1(32,15.05) v1(32,13.14) v1(32,12.51) v1(32.26,29.44) v1(32.26,28.83) v1(32.26,28.19) v1(32.51,44.07) v1(32.64,15.68) v1(32.64,15.05) v1(32.64,13.14) v1(32.64,12.51) v1(32.77,38.61) v1(32.77,37.59) v1(33.02,38.1) v1(33.15,44.07) v1(33.4,33.02) v1(33.6,38.1) v1(33.78,44.07) v1(34.45,40.65) v1(35,40.65) v1(34.99,3.3) v1(34.99,2.67) v1(35.05,56.96) v1(35.05,56.32) v1(35.05,55.69) v1(35.05,55.05) v1(35.18,46.99) v1(35.18,46.36) v1(35.18,45.72) v1(35.69,66.87) v1(35.69,64.83) v1(35.69,64.2) v1(35.69,62.8) v1(35.69,62.17) v1(35.69,56.96) v1(35.69,56.32) v1(35.69,55.69) v1(35.69,55.05) v1(35.62,3.3) v1(35.62,2.67) v1(35.81,46.36) v1(35.81,45.72) v1(35.81,45.08) v1(35.81,8.57) v1(35.81,7.94) v1(36.26,34.35) v1(36.26,33.72) v1(36.32,66.87) v1(36.32,64.83) v1(36.32,64.2) v1(36.32,62.8) v1(36.32,62.17) v1(36.32,56.96) v1(36.32,56.32) v1(36.32,55.69) v1(36.32,55.05) v1(36.45,45.72) v1(36.45,45.08) v1(36.45,44.45) v1(36.45,8.57) v1(36.45,7.94) v1(36.58,22.67) v1(36.58,22.03) v1(36.96,66.87) v1(36.96,64.83) v1(36.96,64.2) v1(36.96,62.8) v1(36.96,62.17) v1(37.08,8.57) v1(37.08,7.94) v1(38.1,36.7) v1(38.1,36.07) v1(38.48,61.59) v1(38.48,60.96) v1(38.48,60.33) v1(38.7,51.91) v1(38.67,31.81) v1(38.67,31.18) v1(38.74,54.86) v1(38.74,54.1) v1(39.31,31.81) v1(39.31,31.18) v1(40.13,13.14) v1(40.13,12.51) v1(40.77,13.14) v1(40.77,12.51) v1(41.08,33.59) v1(41.08,32.96) v1(41.21,27.75) v1(41.21,27.11) v1(41.21,26.42) v1(41.21,25.78) v1(41.4,13.14) v1(41.4,12.51) v1(41.72,33.59) v1(41.72,32.96) v1(41.85,27.75) v1(41.85,27.11) v1(41.85,26.42) v1(41.85,25.78)
VBAT: length 24.9
  Top Layer w0.3: Q3.1 38.36,23.61 Q2.3 ; U17.3 29.3,33.82 C66.2
  Top Layer w0.5: Q2.3 D5.2 39.52,27.47 41.53,29.48 41.16,29.84 37.85,29.84 37.34,30.35 30.61,30.35 30.06,30.9 30.06,33.11 U17.3
VBUS: length 85.3
  Top Layer w0.15: U17.4 32.71,33.85 R2.1
  Top Layer w0.4: 16.16,69.28 17.23,70.35 19.48,70.35 v2(19.84,69.99) 20.4,69.99 20.91,69.48 20.91,69.28
  Top Layer w0.5: v2(41.02,43.76) v2(40.59,44.19) 39.93,43.52 35.89,43.52 D2.2 ; U17.4 31.63,32.76 32.13,32.26 38.1,32.26 v2(40.09,34.25) v2(40.51,34.67)
  Bottom Layer w0.5: v2(40.09,34.25) v2(40.51,34.67) 41.78,35.94 41.78,43 v2(41.02,43.76) v2(40.59,44.19) 41.78,45.38 41.78,66.86 41.05,67.6 22.23,67.6 v2(19.84,69.99)
VCC: length 48.3
  Top Layer w0.3: v1(37.06,35.47) 37.08,35.49 U4.7 ; 35.89,23.52 35.75,23.38 35.75,21.91 36.45,21.21 39.79,21.21 Q3.4
  Top Layer w0.5: C51.2 C52.2 ; C51.2 33.25,41.76 D2.1 33.77,42.75 40.14,42.75 v1(40.64,42.25) v1(40.64,41.71) v1(40.64,41.16) ; C51.2 34.51,39.4 35.07,38.85 U4.2 ; 34.54,23.52 35.89,23.52 Q2.2 ; v1(35.81,23.16) v1(35.81,22.61) v1(35.81,22.06)
  Bottom Layer w0.5: v1(35.81,22.06) v1(35.81,23.16) 35.81,24.26 37.06,25.5 v1(37.06,35.47) 37.06,37.19 40.64,40.77 v1(40.64,41.16) ; 40.64,41.43 v1(40.64,42.25)
BOOT: length 97.5
  Top Layer w0.15: v1(28.16,63.37) 28.67,63.37 29.02,63.72 32.68,63.72 38.2,58.21 38.2,53.16 v1(38.5,52.86) 40.3,51.05 41.27,51.05 41.52,50.8 ; U13.3 17.11,23.15 16.51,23.75 16.51,26.16 v1(16.76,26.42) 16.76,26.78 R4.1 ; 9.96,70.29 10.2,70.29 10.66,69.84 10.66,69.36 10.92,69.09 11.43,69.09 11.68,68.83 11.68,68.02 v1(12.13,67.57)
  Top Layer w0.2: 41.52,50.8 41.83,50.49 BOOT.2
  Bottom Layer w0.15: v1(28.16,63.37) 27.66,63.37 27.31,63.72 23.76,63.72 19.91,67.57 17.32,67.57 16.83,67.09 12.62,67.09 v1(12.13,67.57) ; v1(16.76,26.42) 16.76,25.53 17.05,25.24 26.33,25.24 29.32,28.23 29.32,32.42 38.2,41.31 38.2,52.56 v1(38.5,52.86)
BUS_INT: length 38.6
  Top Layer w0.13: R14.1 10.19,61.63 U9.22
  Top Layer w0.15: U1.37 41.5,63.52 v1(40.39,63.52) ; R14.1 10.3,62.65 10.45,62.8 v1(11.32,62.8)
  Bottom Layer w0.15: v1(11.32,62.8) 11.43,62.91 11.43,65.15 13.09,66.81 17.06,66.81 17.54,67.29 19.84,67.29 24.27,62.85 32.28,62.85 32.94,63.52 v1(40.39,63.52)
C_D2: length 15.1
  Top Layer w0.15: 18.47,42.13 18.47,45.02 20.96,47.5 20.96,53.09 21.21,53.34 U1.12
C_D3: length 15.7
  Top Layer w0.15: 19.47,42.13 19.47,45.23 22,47.75 28.96,47.75 29.59,48.39 29.59,49.52
C_D4: length 16.4
  Top Layer w0.15: 30.86,49.52 30.86,48.51 29.85,47.5 22.1,47.5 19.97,45.38 19.97,42.13
C_D5: length 14.7
  Top Layer w0.15: 28.32,49.52 28.32,48.51 27.81,48.01 21.89,48.01 18.97,45.09 18.97,42.13
C_D6: length 16.1
  Top Layer w0.15: U1.11 22.13,54.61 20.7,53.19 20.7,47.6 17.97,44.88 17.97,42.13
C_D7: length 18.7
  Top Layer w0.15: U1.9 22.71,57.16 22.35,56.79 22.35,55.6 20.19,53.44 20.19,47.81 16.97,44.6 16.97,42.13
C_D8: length 20.4
  Top Layer w0.15: 15.97,42.13 15.97,43.95 19.94,47.92 19.94,53.55 22.1,55.71 22.1,57.89 22.64,58.42 U1.8
C_D9: length 23
  Top Layer w0.15: 14.97,42.13 14.97,43.66 19.44,48.13 19.44,53.76 21.59,55.91 21.59,58.09 21.99,58.49 22.73,59.23 22.73,60.45 23.24,60.97 U1.6
C_HREF: length 25.8
  Top Layer w0.15: 13.47,42.13 13.47,43.45 14.6,44.58 15.53,44.58 19.19,48.23 19.19,53.86 21.34,56.01 21.34,58.19 22.48,59.33 22.48,61.97 22.74,62.23 U1.5
C_PCLK: length 17.1
  Top Layer w0.15: 17.47,42.13 17.47,44.74 20.45,47.71 20.45,53.34 22.99,55.89 U1.10
C_RST: length 27.9
  Top Layer w0.15: U9.3 7.55,63.51 8.12,64.08 11.52,64.08 12.39,63.21 12.39,62.29 13.15,61.53 13.15,49.34 v1(13.61,48.88) ; v1(12.06,44.96) 11.97,44.87 11.97,42.13
  Bottom Layer w0.15: v1(12.06,44.96) 13.61,46.51 v1(13.61,48.88)
C_VSYC: length 27.6
  Top Layer w0.15: 12.47,42.13 12.47,43.56 13.75,44.83 15.43,44.83 18.93,48.34 18.93,53.96 21.09,56.12 21.09,58.3 22.22,59.44 22.22,62.48 23.25,63.5 U1.4
C_XCLK: length 21.4
  Top Layer w0.15: U1.7 23.55,59.69 21.84,57.99 21.84,55.81 19.69,53.65 19.69,48.02 15.47,43.81 15.47,42.13
CC1: length 4.6
  Top Layer w0.13: U3.3 19.69,65.48 19.69,66.67 19.81,66.8 20.31,66.8 R5.1
  Top Layer w0.15: USB1.A5 19.79,67.74 20.31,67.23 20.31,66.8
CC2: length 4.4
  Top Layer w0.13: 16.78,66.8 17.15,66.8 17.27,66.67 17.27,65.61 U3.1 ; 16.78,66.8 16.79,66.82 USB1.B5 ; 16.78,66.8 R3.2
CS3: length 63.3
  Top Layer w0.15: v1(13.6,15.12) 14.95,15.12 TF1.2 ; U1.33 v1(40.39,58.42)
  Top Layer w0.2: R28.2 17.15,19.7 v1(17.15,20.45)
  Bottom Layer w0.15: v1(40.39,58.42) 40.39,48.67 39.47,47.75 39.47,40.74 30.58,31.85 30.58,27.7 26.76,23.88 17.48,23.88 17.13,23.53 17.13,20.43
  Bottom Layer w0.25: v1(13.6,15.12) 17.13,18.65 17.13,20.43
DN: length 27.5
  Top Layer w0.13: USB1.A7 18.29,67.56 18.42,67.44 19.29,67.44 ; USB1.B7 19.29,67.44 ; 19.29,67.44 19.29,66.69 U3.4
  Top Layer w0.15: v1(22.86,52.08) U1.13
  Bottom Layer w0.15: v1(19.07,66.31) 19.07,66.12 18.71,65.76 18.71,64.31 18.86,64.16 v1(18.86,62.79) 18.86,62.39 18.71,62.24 18.71,61.63 17.54,60.46 17.54,52.19 18.14,51.59 18.77,51.59 18.87,51.68 18.87,52.09 18.97,52.19 19.09,52.19 19.19,52.09 19.19,51.71 19.3,51.59 19.64,51.59 19.73,51.68 19.73,51.84 19.84,51.94 19.99,51.94 20.09,51.84 20.09,51.69 20.19,51.59 22,51.59 22.48,52.08 v1(22.86,52.08)
DP: length 27.7
  Top Layer w0.13: USB1.A6 18.8,68.65 18.8,69.72 18.67,69.85 17.91,69.85 17.79,69.73 USB1.B6 17.79,66.69 U3.6
  Top Layer w0.15: 24.02,50.8 24.01,50.81 v1(22.86,50.81)
  Bottom Layer w0.15: v1(18.02,66.31) 18.02,66.16 18.41,65.76 18.41,64.31 18.26,64.16 v1(18.26,62.79) 18.26,62.39 18.41,62.24 18.41,61.75 17.24,60.58 17.24,52.07 18.02,51.29 21.99,51.29 22.47,50.81 v1(22.86,50.81)
I2S_LRCK: length 85.9
  Top Layer w0.15: v1(28.16,63.97) 32.79,63.97 38.76,58.01 v1(38.76,56.33) 39.2,55.89 U1.31 ; U13.2 17.56,24.42 18.54,25.4 v1(18.54,25.91) ; U14.7 10.36,70.69 10.91,70.15 10.91,69.62 11.06,69.47 11.94,69.47 12.13,69.27 v1(12.13,68.26)
  Bottom Layer w0.15: v1(18.54,25.91) 18.96,25.49 26.22,25.49 29.07,28.33 29.07,32.53 37.95,41.41 37.95,55.52 v1(38.76,56.33) ; v1(12.13,68.26) 13.06,67.34 16.73,67.34 17.21,67.82 20.02,67.82 23.86,63.97 v1(28.16,63.97)
I2S_MCLK: length 36.6
  Top Layer w0.15: 7.15,70.29 7.19,70.25 v1(7.19,69.89) ; v1(25.5,64.79) 25.78,64.51 25.78,49.52
  Bottom Layer w0.15: v1(25.5,64.79) 23.76,64.79 20.22,68.33 17,68.33 16.52,67.84 13.74,67.84 12.56,69.02 11.52,69.02 10.66,69.89 v1(7.19,69.89)
I2S_SDI: length 48.3
  Top Layer w0.15: U13.4 16.98,21.88 16.51,22.35 16.51,23.11 16.26,23.37 16.26,25.14 v1(16,25.4) ; 39.75,49.55 39.75,50.54 39.22,51.07 v1(38.75,51.07)
  Bottom Layer w0.15: v1(38.75,51.07) 38.75,49.06 38.46,48.77 38.46,41.2 29.57,32.32 29.57,28.12 26.43,24.99 16.42,24.99 v1(16,25.4)
I2S_SDO: length 40.5
  Top Layer w0.13: U14.3 8.55,69.37 8.14,68.96 R21.1
  Top Layer w0.15: v1(10.68,68.28) 8.42,68.28 8.14,68.57 R21.1 ; U1.32 39.97,57.16 32.89,64.23 29.02,64.23 28.67,64.58 v1(28.16,64.58)
  Bottom Layer w0.15: v1(10.68,68.28) 11.19,68.28 11.68,68.77 12.36,68.77 13.54,67.59 16.62,67.59 17.11,68.08 20.12,68.08 23.97,64.23 27.31,64.23 27.66,64.58 v1(28.16,64.58)
LCD_BLK: length 34
  Top Layer w0.15: v1(9.99,45.61) 12.65,48.27 12.65,61.32 11.88,62.08 11.88,63 11.39,63.5 8.77,63.5 U9.1 ; R19.2 10.42,34.55 v1(9.97,34.55)
  Bottom Layer w0.15: v1(9.97,34.55) 9.99,34.57 v1(9.99,45.61)
LCD_CS: length 21.4
  Top Layer w0.15: v1(34.68,50.51) 34.68,49.53 34.67,49.52 ; FPC1.14 v1(23.59,39.8)
  Bottom Layer w0.15: v1(23.59,39.8) 23.59,40.44 25.88,42.73 28.43,42.73 30.7,45 30.7,50.2 31.72,51.22 33.97,51.22 v1(34.68,50.51)
LCD_DC: length 19.5
  Top Layer w0.15: FPC1.15 24.09,39.61 v1(24.27,39.8) ; v1(33.4,50.51) 33.4,49.52
  Bottom Layer w0.15: v1(24.27,39.8) 24.27,40.77 25.98,42.48 28.53,42.48 30.95,44.89 30.95,50.1 31.82,50.97 32.94,50.97 v1(33.4,50.51)
LCD_MOSI: length 23.4
  Top Layer w0.15: FPC1.13 23.09,39.66 v1(22.95,39.8) ; v1(35.95,50.51) 35.95,49.53 35.94,49.52
  Bottom Layer w0.15: v1(35.95,50.51) 34.98,51.48 31.62,51.48 30.44,50.3 30.44,45.1 28.32,42.98 25.77,42.98 22.95,40.16 v1(22.95,39.8)
LCD_SCLK: length 17.7
  Top Layer w0.15: 32.13,49.52 32.13,49.53 v1(32.13,50.49) ; v1(24.94,39.8) 24.59,39.45 FPC1.16
  Bottom Layer w0.15: v1(24.94,39.8) 24.94,39.95 24.52,40.36 24.52,40.67 26.09,42.23 28.64,42.23 31.2,44.79 31.2,49.98 31.71,50.49 v1(32.13,50.49)
MISO3: length 65.5
  Top Layer w0.15: U1.34 v1(40.39,59.69)
  Top Layer w0.2: TF1.7 16.42,20.61 v1(16.44,20.62) 16.9,21.08 19.18,21.08 19.94,20.32 19.94,17.24 19.69,16.98 U2.2
  Bottom Layer w0.15: v1(16.44,20.62) 16.44,23.38 17.29,24.23 26.76,24.23 30.33,27.8 30.33,31.96 39.22,40.84 39.22,48.09 39.86,48.73 39.86,59.16 v1(40.39,59.69)
MOSI3: length 75
  Top Layer w0.15: U1.35 v1(40.39,60.97) ; v1(13.61,16.19) 14.94,16.19 TF1.3
  Top Layer w0.2: v1(13.61,16.19) 13.08,15.66 13.08,13.72 13.72,13.08 16.38,13.08 17.15,12.32 U2.5
  Bottom Layer w0.15: v1(40.39,60.97) 39.59,60.16 39.59,49.05 38.96,48.42 38.96,40.99 30.08,32.11 30.08,27.92 26.64,24.48 16.86,24.48 15.88,23.5 15.88,17.91 14.16,16.19 v1(13.61,16.19)
P0: length 50.8
  Top Layer w0.15: v1(39.57,65.4) 40.21,66.05 U1.39 ; C_P0.3 5.26,54.9 v1(6.12,54.9) ; v1(26.31,64.94) v1(26.31,62.29)
  Bottom Layer w0.15: v1(39.57,65.4) 26.77,65.4 v1(26.31,64.94) ; v1(26.31,62.29) 24.37,62.29 19.68,66.98 17.71,66.98 17.2,66.48 13.77,66.48 12.65,65.36 12.65,62.05 12.14,61.53 12.14,60.41 11.22,59.49 11.22,56.89 10.71,56.38 8.46,56.38 8.05,55.97 8.05,55.39 7.56,54.9 v1(6.12,54.9)
P1: length 25.6
  Top Layer w0.15: v1(3.25,57.5) 3.25,60.02 3.67,60.44 3.67,61.73 4.07,62.13 U9.8 ; C_P1-3.3 4.2,39.88 v1(4.18,39.9)
  Bottom Layer w0.15: v1(4.18,39.9) 3,41.08 3,57.24 v1(3.25,57.5)
P2: length 26.6
  Top Layer w0.15: U9.16 7.54,59.46 v1(7.54,58.72) ; C_P1-3.4 4.18,38.88 v1(4.18,38.88)
  Bottom Layer w0.15: v1(4.18,38.88) 2.74,40.32 2.74,57.64 3.11,58.01 7.14,58.01 7.54,58.42 v1(7.54,58.72)
P3: length 27.3
  Top Layer w0.15: U9.15 7.05,58.84 v1(6.93,58.72) ; C_P1-3.5 v1(4.18,37.88)
  Bottom Layer w0.15: v1(4.18,37.88) 2.49,39.56 2.49,57.75 3,58.26 6.47,58.26 v1(6.93,58.72)
P4: length 35
  Top Layer w0.15: v1(6.22,58.72) 6.55,59.06 U9.14 ; C_P4-7.3 v1(4.18,30.73)
  Bottom Layer w0.15: v1(4.18,30.73) 2.95,30.73 2.24,31.44 2.24,58.01 2.85,58.62 6.11,58.62 v1(6.22,58.72)
P5: length 35.7
  Top Layer w0.15: v1(4.53,59.16) 5.74,59.16 U9.13 ; C_P4-7.4 v1(4.18,29.73)
  Bottom Layer w0.15: v1(4.18,29.73) 3.59,29.73 1.99,31.33 1.99,58.72 2.42,59.16 v1(4.53,59.16)
P6: length 37.2
  Top Layer w0.15: C_P4-7.5 v1(4.18,28.73) ; U9.10 5.39,61.12 4.38,61.12 4.06,60.8 4.06,60.09 v1(3.87,59.9)
  Bottom Layer w0.15: v1(4.18,28.73) 1.74,31.17 1.74,58.83 2.8,59.9 v1(3.87,59.9)
P7: length 69.3
  Top Layer w0.15: U9.11 5.38,60.61 v1(4.69,60.61) ; C_P4-7.6 v1(4.18,27.73)
  Top Layer w0.2: v1(5.21,26.42) 5.24,26.45 C_P4-7.6
  Top Layer w0.25: R39.1 v1(11.18,5.72)
  Bottom Layer w0.15: v1(4.18,27.73) 1.48,30.42 1.48,58.93 3.16,60.61 v1(4.69,60.61)
  Bottom Layer w0.2: v1(5.21,26.42) 6.64,26.42 7.7,25.36 7.7,8.13 7.27,7.7 SW3.2
  Bottom Layer w0.25: SW3.1 13.97,5.72 v1(11.18,5.72) 7.36,5.72 SW3.2
P8: length 93.3
  Top Layer w0.15: U9.12 5.21,59.94 v1(4.57,59.94)
  Top Layer w0.25: v1(26.8,4.95) 26.29,5.46 R37.1
  Bottom Layer w0.15: v1(4.57,59.94) 5.08,59.94 5.33,60.2 5.33,60.96 5.04,61.26 4.06,61.26
  Bottom Layer w0.2: 4.06,61.26 3.41,61.26 1.21,59.05 1.21,30.3 3.41,28.1 3.41,27.37 3.56,27.23 6.68,27.23 8.3,25.61 8.3,8.25 9.27,7.29 15.87,7.29 16.43,6.73 26.67,6.73 27.59,5.81 27.65,5.81
  Bottom Layer w0.25: v1(26.8,4.95) 27.65,5.81 ; SW1.2 28.95,5.46 35.06,5.46 SW1.1
P9: length 82.3
  Top Layer w0.13: v1(5.08,63.81) 6.24,63.81 6.55,63.5 U9.5
  Top Layer w0.25: R38.1 v1(18.67,5.59)
  Bottom Layer w0.15: v1(5.08,63.81) 5.01,63.81 3.43,62.23
  Bottom Layer w0.2: 3.43,62.23 3.11,61.91 3.11,61.38 0.9,59.17 0.9,30.18 3.11,27.97 3.11,27.24 3.43,26.93 6.56,26.93 8,25.48 8,8.13 9.14,6.98 15.75,6.98 16.92,5.81 SW2.2
  Bottom Layer w0.25: v1(18.67,5.59) 18.16,5.59 SW2.2 ; 18.67,5.81 SW2.1
P10: length 5.5
  Top Layer w0.13: C21.2 4.34,65.17 3.82,64.66 R7.1 2.7,64.52 2.62,64.6
  Top Layer w0.15: 3.82,64.51 3.82,63.67 4.2,63.29 U9.6
P11: length 7.7
  Top Layer w0.13: 2.62,67 3.77,67 R6.1 3.82,66.33 C20.2
  Top Layer w0.15: C20.2 3.39,66.29 v1(3.36,66.27) ; v1(3.36,63.77) 3.36,63.36 4.1,62.63 U9.7
  Bottom Layer w0.15: v1(3.36,63.77) v1(3.36,66.27)
RGB: length 70.7
  Top Layer w0.15: v1(26.62,48.52) 27.05,48.95 27.05,49.52
  Top Layer w0.2: v1(1.65,5.21) 1.65,6.6 1.91,6.86 9.02,6.86 9.4,7.24 v1(9.4,8.13)
  Bottom Layer w0.2: v1(26.62,48.52) 20.58,48.52 16.26,44.2 10.8,44.2 10.41,43.81 10.41,42.67 10.8,42.29 12.19,42.29 12.7,41.79 12.7,8.63 12.19,8.13 v1(9.4,8.13) ; RGB1.3 2.22,5.21 v1(1.65,5.21)
RST: length 4.5
  Top Layer w0.15: R1.1 21.05,64.37 21.56,64.89 22.29,64.89 22.4,64.77 U1.3
  Top Layer w0.2: RST.1 R1.1
SCL: length 139.8
  Top Layer w0.15: v1(11.73,59.13) 11.72,59.12 10.66,59.12 9.65,60.13 U9.19 ; v1(36.82,51.94) 38.86,49.9 38.48,49.52 ; U18.10 9.05,67.09 9.2,67.24 10.84,67.24 v1(10.91,67.31) ; 9.96,53.52 U5.12 ; 9.96,53.52 9.96,51.6 6.12,47.76 C_I2C.3 ; 9.96,53.52 v1(11.01,53.52) ; U14.19 6.66,70.69 v1(6.37,70.4) ; v1(11.03,66.2) 11.14,66.2 13.1,64.23 v1(13.41,64.23) ; v1(9.91,30.1) 8.68,30.1 8.51,30.27 8.51,38.76 10.01,40.26 10.8,40.26 11.47,40.94 11.47,45.26 15.62,49.4 16.35,49.4 16.83,49.88 v1(16.83,50.38) ; v1(11.11,29.43) 13.99,29.43 14.97,28.45 26.34,28.45 27.33,27.46 27.33,25.88 27.69,25.52 28.95,25.52 29.21,25.78 29.21,26.62 29.21,26.62 ; U10.12 v1(11.11,27.61)
  Top Layer w0.2: R13.1 38.48,48.65 38.48,49.52 ; U10.12 11.11,25.23 R34.1
  Bottom Layer w0.15: v1(11.11,27.61) v1(11.11,29.43) 11.11,29.74 10.74,30.1 v1(9.91,30.1) ; HUM.3 7.52,73.9 7.85,73.56 8.34,73.56 8.63,73.85 8.63,74.1 8.96,74.43 11.27,74.43 11.42,74.28 11.42,72.95 11.22,72.76 10.43,72.76 9.78,73.41 8.9,73.41 8.25,72.76 8.25,71.4 7.72,70.86 7.23,70.86 6.77,70.4 v1(6.37,70.4) 6.37,69.32 6.87,68.82 9.4,68.82 v1(10.91,67.31) 10.91,66.32 v1(11.03,66.2) ; v1(36.82,51.94) 36.57,52.19 27.33,52.19 25.3,50.16 17.78,50.16 17.56,50.38 v1(16.83,50.38) 16.51,50.7 16.51,52.58 15.57,53.52 v1(11.01,53.52) 11.01,54.03 11.73,54.74 v1(11.73,59.13) 12.19,59.13 12.64,59.59 12.64,61.32 13.16,61.84 13.16,63.98 v1(13.41,64.23)
SCLK3: length 75.5
  Top Layer w0.15: TF1.5 14.93,18.38 v1(13.61,18.38) ; U1.36 v1(40.39,62.23)
  Top Layer w0.2: TF1.5 15.93,18.41 16.27,18.07 16.27,14.09 18.42,11.94 U2.6
  Bottom Layer w0.15: v1(40.39,62.23) 39.33,61.18 39.33,49.29 38.71,48.66 38.71,41.1 29.83,32.21 29.83,28.02 26.54,24.73 16.48,24.73 15.49,23.75 15.49,18.8 15.08,18.38 v1(13.61,18.38)
SDA: length 131.8
  Top Layer w0.15: U5.2 11.68,54.56 ; 11.68,54.56 12.19,55.07 v1(12.19,59.74) 10.4,59.74 9.53,60.61 9.23,60.61 U9.20 ; 11.68,54.56 v1(11.68,52.96) 7.03,48.32 7.03,47.25 6.55,46.76 C_I2C.4 ; U10.11 10.46,27.61 v1(10.45,27.61) ; U14.18 v1(6.37,71.09) ; v1(16.19,49.85) 15.7,49.85 10.47,44.62 10.47,41.08 8.25,38.86 8.25,30.16 8.92,29.5 v1(10.45,29.5) 10.57,29.5 10.93,29.86 13.92,29.86 15.07,28.7 26.55,28.7 27.59,27.66 27.59,26.05 27.86,25.78 28.44,25.78 28.71,26.05 28.71,26.62 ; v1(36.82,51.12) 37.21,50.73 37.21,49.52 ; v1(9.54,66.75) 11.26,66.75 13.1,64.91 v1(13.1,64.89)
  Top Layer w0.2: U18.9 9.48,66.69 v1(9.54,66.75) ; U10.11 10.46,25.2 R33.2 ; 37.21,49.52 37.21,48.28 38.25,47.25 39.13,47.25 R12.2
  Bottom Layer w0.15: LS.6 10.68,74.05 10.12,74.05 9.97,73.9 9.04,73.9 8,72.86 8,71.5 7.62,71.12 6.39,71.12 v1(6.37,71.09) 5.81,70.53 5.81,70.04 6.1,69.76 6.1,69.24 6.77,68.57 7.63,68.57 9.45,66.75 v1(9.54,66.75) ; v1(13.1,64.89) 12.9,64.69 12.9,61.94 12.39,61.43 12.39,59.95 v1(12.19,59.74) ; v1(11.68,52.96) 15.78,52.96 16.26,52.48 16.26,49.91 v1(16.19,49.85) 25.45,49.85 27.54,51.94 36,51.94 v1(36.82,51.12) ; v1(10.45,27.61) v1(10.45,29.5)
SE_RST: length 11.1
  Top Layer w0.15: v1(7.37,64.01) 7.05,63.7 U9.4 ; v1(6.01,68.45) 6.73,68.45 6.97,68.22 U18.14
  Bottom Layer w0.15: v1(7.37,64.01) 7.62,64.26 9.14,64.26 9.4,64.52 9.4,65.02 9.14,65.28 8.09,65.28 7.64,65.72 7.64,67.54 7.24,67.94 6.22,67.94 6.01,68.16 v1(6.01,68.45)
TS_INT: length 70.6
  Top Layer w0.15: U10.10 9.81,27.58 v1(9.84,27.61) ; U1.38 40.22,64.77 v1(38.3,62.85) ; v1(9.84,28.89) 14.17,28.89 14.86,28.2 25.78,28.2 v1(26.82,27.15) 26.82,25.63 27.18,25.27 29.34,25.27 29.72,25.65 29.72,26.62 29.71,26.62
  Bottom Layer w0.15: v1(26.82,27.15) 27.53,27.15 28.82,28.44 28.82,32.63 37.7,41.51 37.7,62.26 v1(38.3,62.85) ; v1(9.84,27.61) v1(9.84,28.89)
TS_RST: length 66.4
  Top Layer w0.15: 30.21,26.62 30.21,25.77 29.4,24.96 27.11,24.96 26.29,25.78 26.29,27.02 25.37,27.94 14.76,27.94 14.28,28.43 9.64,28.43 8.89,29.18 8.84,29.18 8.01,30 8.01,30.05 8,30.06 8,42.86 12.9,47.76 12.9,61.42 12.55,61.78 12.54,61.78 12.13,62.19 12.13,63.11 11.42,63.82 8.34,63.82 8.05,63.54 U9.2
U_LED: length 18.3
  Top Layer w0.15: v1(8.21,58.72) 8.05,58.88 U9.17
  Bottom Layer w0.15: v1(8.21,58.72) 6.92,60.01 6.92,62.46 6.64,62.74 6.1,62.74 5.79,63.04 5.79,64.72 6.11,65.03 7,65.03 7.39,65.43 7.39,67.24 7.08,67.55 6.17,67.55 5.45,68.26 5.45,70.5 5.2,70.76 5.2,71.47 5.62,71.89 R16.1
VLDO: length 3.2
  Top Layer w0.15: U4.15 36.08,39.61 36.2,39.5 36.96,39.5 37.08,39.62 37.08,40.12 U4.13
  Top Layer w0.3: C54.1 36.08,40.97 U4.15
X+: length 10.3
  Top Layer w0.13: FPC1.4 18.59,38.47 18.16,38.04 18.16,35.83 15.81,33.48 13.31,33.48 13.06,33.22 U10.2
X-: length 10.8
  Top Layer w0.13: FPC1.2 17.59,38.28 17.69,38.17 17.69,36.02 15.61,33.94 12.7,33.94 11.75,33 U10.4
Y+: length 10.5
  Top Layer w0.13: U10.3 12.41,33.03 13.08,33.71 15.71,33.71 17.93,35.92 17.93,38.17 18.09,38.33 FPC1.3
Y-: length 11.3
  Top Layer w0.13: FPC1.1 17.09,38.43 17.46,38.06 17.46,36.12 15.52,34.17 12.27,34.17 11.11,33.01 U10.5
$1N44281: length 2.7
  Top Layer w0.2: R27.2 17.28,18.68 17.78,19.18 17.78,19.55 R28.1 18.62,19.56 Q5.1
$1N44298: length 12
  Top Layer w0.25: U2.1 20.96,12.57 21.72,11.81 21.72,7.5 R29.1
  Top Layer w0.3: Q5.3 20.96,18.91 U2.1
$1N44462: length 1.8
  Top Layer w0.25: R31.2 19.75,8.97 U2.7
$2N1472: length 1.8
  Top Layer w0.3: U4.11 38.23,40.85 C56.1
$2N1473: length 1.4
  Top Layer w0.3: C57.1 37.58,35.41 U4.8
$2N1474: length 5.8
  Top Layer w0.3: C57.2 39.02,35.05 L1.2
  Top Layer w0.5: L1.2 39.71,37.6 U4.9
$2N1475: length 5.9
  Top Layer w0.3: L1.1 40.64,39.28 C56.2
  Top Layer w0.5: L1.1 39.7,38.33 U4.10
$2N1478: length 2.2
  Top Layer w0.15: U4.5 36.08,35.83 35.83,35.57 R24.1 35.82,35.17 R23.1
$2N1482: length 3.6
  Top Layer w0.15: R25.2 41.64,22.61 Q3.5 ; Q3.6 Q3.5 ; Q3.5 Q3.2
$2N1494: length 6.8
  Top Layer w0.15: Q2.1 35.89,25.76 34.54,25.76 ; Q3.3 38.24,21.96 37.59,22.61 37.35,22.61 R26.2
  Top Layer w0.3: R26.2 37.34,24.31 Q2.1
$2N4221: length 7
  Top Layer w0.15: LED1.2 29.97,38.34 29.97,36.45 30.48,35.94 30.48,35.05 30.99,34.54 32.5,34.54 R2.2
$2N4223: length 1.7
  Top Layer w0.15: LED1.1 29.34,35.76 U17.1
$2N4224: length 2.9
  Top Layer w0.15: R40.2 32.69,35.75 U17.5 31.31,35.75 30.61,36.45 R41.1
$2N4225: length 1
  Top Layer w0.15: R42.1 R41.2
$3N4430: length 3.9
  Top Layer w0.15: U18.15 6.42,67.94 C67.2 5.12,67.93 5.12,66.42 5.24,66.29 U18.18
$3N4515: length 1.5
  Top Layer w0.15: R43.1 8.19,67.82 U18.11
$4N855: length 9.6
  Top Layer w0.3: v1(15.81,38.98) 15.42,39.37 R17.2 ; v1(19.07,39.7) 19.09,39.68 FPC1.5 FPC1.6 FPC1.7 FPC1.8
  Bottom Layer w0.3: v1(15.81,38.98) 18.36,38.98 v1(19.07,39.7)
$4N856: length 1.9
  Top Layer w0.3: Q4.3 11.43,38.62 R17.1
$4N857: length 2.5
  Top Layer w0.13: R18.2 R19.1 10.91,35.19 10.48,35.62 Q4.1
$4N864: length 4.3
  Top Layer w0.2: FPC1.17 25.09,38.16 25.27,37.97 26.29,37.97 26.96,38.64 C25.2 27.69,39.24 R20.1
$4N2005: length 2.1
  Top Layer w0.2: 12.97,42.13 12.97,41.14 R32.1
$5N1165: length 1.4
  Top Layer w0.15: R15.1 5.17,70.73 PWR.2
$5N1166: length 1.4
  Bottom Layer w0.13: R16.2 4.8,72.38 IND.2
$5N3637: length 36.3
  Bottom Layer w0.2: RGB2.3 38.29,4.83 27.94,4.83 27.31,4.19 26.16,4.19 25.65,4.7 5.46,4.7 5.08,5.08 5.08,5.97 4.76,6.29 RGB1.1
$6N1541: length 2.4
  Bottom Layer w0.13: C27.2 20.98,73 20.43,73.55 C6.2 20.38,73.61 MIC1.2
$6N1543: length 12.2
  Top Layer w0.13: v1(10.87,70.99) 10.87,71 10.38,71.49 9.96,71.49
  Bottom Layer w0.13: v1(10.87,70.99) 10.87,70.99 19.69,70.99 19.94,71.25 19.94,72.41 C27.1
$6N1544: length 7
  Top Layer w0.13: v1(10.87,71.59) 10.57,71.89 9.96,71.89
  Bottom Layer w0.13: C28.1 16.13,72.12 16.13,71.63 15.88,71.37 11.76,71.37 11.54,71.59 v1(10.87,71.59)
$6N1560: length 3.6
  Top Layer w0.13: C40.2 2.18,71.99 1.63,72.54 C38.2 1.42,72.64 v1(1.14,72.64)
  Bottom Layer w0.13: v1(1.14,72.64) 1.78,72.64 2.56,73.42 MIC2.2
$6N1562: length 4.9
  Top Layer w0.13: C39.1 5.36,71.99 5.89,72.52 7.74,72.52 7.75,72.5
$6N1563: length 6
  Top Layer w0.13: C38.1 2.01,71.5 5.2,71.5 5.58,71.88 7.13,71.88 7.15,71.89
$6N1575: length 1.4
  Top Layer w0.13: C42.2 9.78,73.39 9.35,72.96 U14.11
$6N1576: length 1.5
  Top Layer w0.13: C43.2 7.89,73.39 8.15,73.13 8.15,72.5
$6N1590: length 18.7
  Top Layer w0.5: U13.8 22.51,25.69 21.97,25.15 v2(21.97,20.57)
  Bottom Layer w0.5: NOREF#4.2 34.58,20.57 v2(21.97,20.57)
$6N1591: length 21.9
  Top Layer w0.5: U13.5 23.19,21.01 24.13,20.07 30.67,20.07 33.47,17.27 39.12,17.27 NOREF.1

## Copper pours and planes (outline as drawn; the poured copper is in the pictures)
GND on Top Layer: 0,0 42.67,0 42.67,68.33 23.77,68.33 23.77,74.93 0,74.93
GND on Bottom Layer: 0,0 42.67,0 42.67,68.33 23.77,68.33 23.77,74.93 0,74.93

Small or netless copper shapes (teardrops, artwork), in the pictures only: 516 on Top Layer, 202 on Bottom Layer

## Text on the board
Top Silkscreen Layer: + | - | P4 | P3 | P6 | P1 | P2 | P7 | P5 | PO | SDA | SCL | BOOST | Z | Y | X | CAMERA | IO 1 | I2C | IO 2 | IO 3 | SPEAKER
